# EAGLE design FB_BJ_Taster_1.53 (EAGLE 5.04)
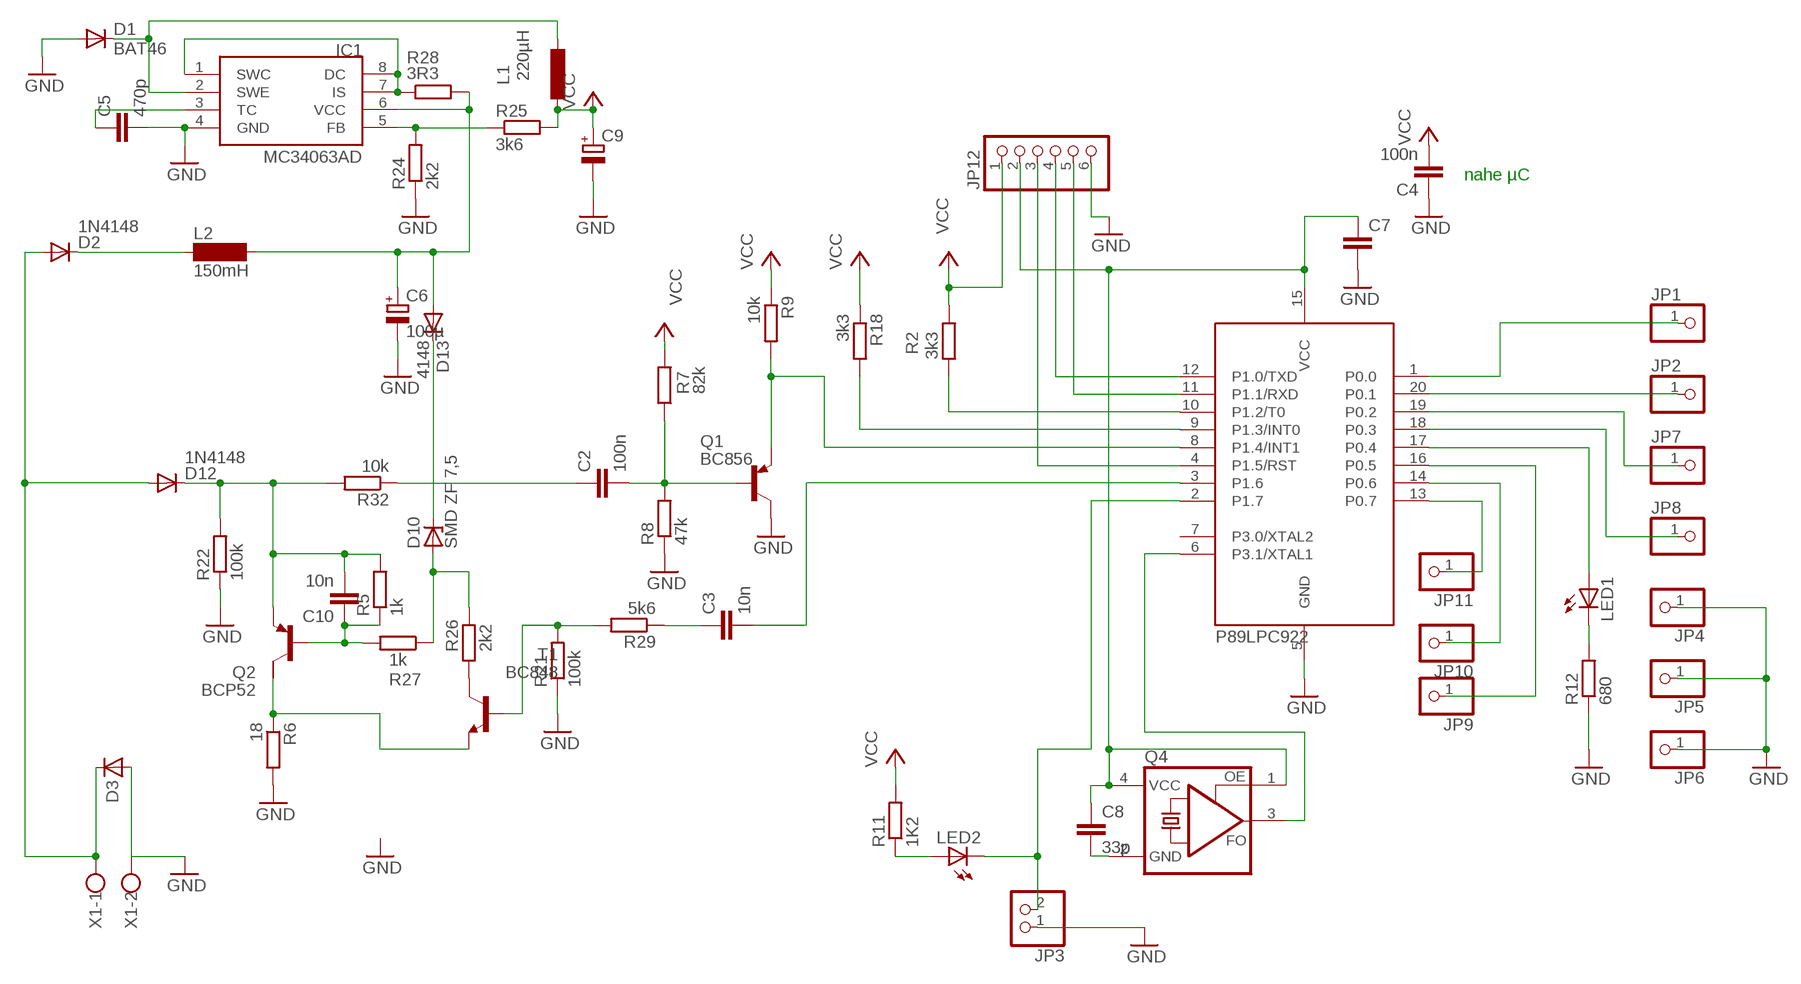
[diagram p0: schematic, sheet 1]

## Parts
C2  100n  C-EUC1206  [C1206]
C3  10n  C-EUC1206  [C1206]
C4  100n  C-EUC1206  [C1206]
C5  470p  C-EUC1206  [C1206]
C6  100µ  CPOL-EUE5-8.5  [E5-8,5]
C7  C-EUC1206  [C1206]
C8  33p  C-EUC1206  [C1206]
C9  CPOL-EUE2.5-5  [E2,5-5]
C10  10n  C-EUC1206  [C1206]
D1  BAT46  DIODE-MINIMELF  [MINIMELF]
D2  1N4148  DIODE-MINIMELF  [MINIMELF]
D3  D-SMB  [SMB]
D10  SMD ZF 7,5  ZPD  [MINIMELF]
D12  1N4148  DIODE-MINIMELF  [MINIMELF]
D13  4148  DIODE-MINIMELF  [MINIMELF]
IC1  MC34063AD  [SOIC8]
JP1  PINHD-1X1  [1X01]
JP2  PINHD-1X1  [1X01]
JP3  PINHD-1X2  [1X02]
JP4  PINHD-1X1  [1X01]
JP5  PINHD-1X1  [1X01]
JP6  PINHD-1X1  [1X01]
JP7  PINHD-1X1  [1X01]
JP8  PINHD-1X1  [1X01]
JP9  PINHD-1X1  [1X01]
JP10  PINHD-1X1  [1X01]
JP11  PINHD-1X1  [1X01]
JP12  PINHD-1X6  [1X06]
L1  220µH  L-EU2200-11.43  [2200-11.43]
L2  150mH  SD12-1000  [SD12_1000]
LED1  LED3MM  [LED3MM]
LED2  LED3MM  [LED3MM]
Q1  BC856  BC856ALT1SMD  [SOT23-BEC]
Q2  BCP52  FZT753SMD  [SOT223]
Q4  ASFL  [ASF]
R2  3k3  R-EU_M1206  [M1206]
R5  1k  R-EU_R1206  [R1206]
R6  18  R-EU_R1206  [R1206]
R7  82k  R-EU_R1206  [R1206]
R8  47k  R-EU_M1206  [M1206]
R9  10k  R-EU_R1206  [R1206]
R11  1K2  R-EU_R1206  [R1206]
R12  680  R-EU_R1206  [R1206]
R18  3k3  R-EU_R1206  [R1206]
R21  100k  R-EU_R1206  [R1206]
R22  100k  R-EU_M1206  [M1206]
R24  2k2  R-EU_R1206  [R1206]
R25  3k6  R-EU_M1206  [M1206]
R26  2k2  R-EU_M1206  [M1206]
R27  1k  R-EU_R1206  [R1206]
R28  3R3  R-EU_M1206  [M1206]
R29  5k6  R-EU_R1206  [R1206]
R32  10k  R-EU_R1206  [R1206]
T1  BC848  [SOT23]
U1  89LPC922  [DIL20]
X1  W237-02P  [W237-132]

## Nets
DRAIN: R26.1 T1.3(C)
EIB+: D2.A D3.1(C) D12.A X1.1
EIB_DC1: C6.+ D13.A IC1.6(VCC) L2.2 R28.2
EIB_SEND: C3.2 U1.3(P1.6)
EIBIN: Q1.E R9.2 U1.8(P1.4/INT1)
GATE: R21.2 R29.2 T1.1(B)
GND: C4.1 C5.2 C6.- C7.2 C9.- D1.A D3.2(A) IC1.4(GND) JP3.1 JP4.1 JP5.1 JP6.1 JP12.6 Q1.C R6.2 R8.1 R12.1 R21.1 R22.1 R24.1 U1.5(GND) X1.2
INT0: R18.2 U1.9(P1.3/INT0)
N$1: C10.1 Q2.1(B) R5.1 R27.2
N$2: C3.1 R29.1
N$5: C10.2 D12.C Q2.3(E) R5.2 R22.2 R32.2
N$6: Q2.2(C) R6.1 T1.2(E)
N$8: D2.C L2.1
N$15: LED1.A U1.17(P0.4)
N$16: JP12.3 U1.4(P1.5/RST)
N$17: JP3.2 LED2.K(C) U1.2(P1.7)
N$18: LED1.K(C) R12.2
N$19: LED2.A R11.1
N$20: JP7.1 U1.19(P0.2)
N$21: JP1.1 U1.1(P0.0)
N$22: JP2.1 U1.20(P0.1)
N$23: JP8.1 U1.18(P0.3)
N$24: JP12.4 U1.12(P1.0/TXD)
N$25: Q4.3(FO) U1.6(P3.1/XTAL1)
N$26: JP12.5 U1.11(P1.1/RXD)
N$27: C8.2 Q4.2(GND)
N$28: JP9.1 U1.16(P0.5)
N$29: JP11.1 U1.13(P0.7)
N$30: JP10.1 U1.14(P0.6)
N$31: C2.2 Q1.B R7.1 R8.2
N$50: IC1.5(FB) R24.2 R25.1
N$51: D1.C IC1.2(SWE) L1.2
N$52: C5.1 IC1.3(TC)
N$55: D10.A R26.2 R27.1
N$58: D10.C D13.C
N$63: IC1.1(SWC) IC1.7(IS) IC1.8(DC) R28.1
N$77: C2.1 R32.1
PWM: R2.2 U1.10(P1.2/T0)
VCC: C4.2 C9.+ JP12.1 L1.1 R2.1 R7.2 R9.1 R11.2 R18.1 R25.2
VCC_LPC: C7.1 C8.1 JP12.2 Q4.1(OE) Q4.4(VCC) U1.15(VCC)
Unconnected: Q2.4(C/) U1.7(P3.0/XTAL2)

## Notes on the sheet
- nahe µC
- P89LPC922

## Library data of the parts
C2-C5 C7 C8 C10 = rcl:C-EU: CAPACITOR, European symbol
C6 C9 = rcl:CPOL-EU: POLARIZED CAPACITOR, European symbol
D1 D2 D12 D13 = diode:DIODE-: DIODE
D3 = semicon-smd-ipc:D-: DIODE unfilled
D10 = diode:ZPD: Z DIODE 500 mW
IC1 = mc34063:MC34063
JP1 JP2 JP4-JP11 = pinhead:PINHD-1X1: PIN HEADER
JP3 = pinhead:PINHD-1X2: PIN HEADER
JP12 = pinhead:PINHD-1X6: PIN HEADER
L1 = rcl:L-EU: INDUCTOR, European symbol
L2 = inductor-neosid:SD12: INDUCTOR nominal inductance
LED1 LED2 = led:LED: LED OSRAM: - CHIPLED LG R971, LG N971, LY N971, LG Q971, LY Q971, LO R971, LY R971 LH N974, LH R974 LS Q976, LO Q976, LY Q976 LO Q996 - Hyper CHIPLED LW Q18S LB Q993, LB Q99A, LB R99A - SideLED LS A670, LO A670, LY A670, LG A670, LP A670 LB A673, LV A673, LT A673, LW A673 LH A674 LY A675 LS A676, LA A676, LO A676, LY A676, LW A676 LS A679, LY A679, LG A679 - Hyper Micro SIDELED® LS Y876, LA Y876, LO Y876, LY Y876 LT Y87S - SmartLED LW L88C, LW L88S LB L89C, LB L89S, LG L890 LS L89K, LO L89K, LY L89K LS L896, LA L896, LO L896, LY L896 - TOPLED LS T670, LO T670, LY T670, LG T670, LP T670 LSG T670, LSP T670, LSY T670, LOP T670, LYG T670 LG T671, LOG T671, LSG T671 LB T673, LV T673, LT T673, LW T673 LH T674 LS T676, LA T676, LO T676, LY T676, LB T676, LH T676, LSB T676, LW T676 LB T67C, LV T67C, LT T67C, LS T67K, LO T67K, LY T67K, LW E67C LS E67B, LA E67B, LO E67B, LY E67B, LB E67C, LV E67C, LT E67C LW T67C LS T679, LY T679, LG T679 LS T770, LO T770, LY T770, LG T770, LP T770 LB T773, LV T773, LT T773, LW T773 LH T774 LS E675, LA E675, LY E675, LS T675 LS T776, LA T776, LO T776, LY T776, LB T776 LHGB T686 LT T68C, LB T68C - Hyper Mini TOPLED® LB M676 - Mini TOPLED Santana® LG M470 LS M47K, LO M47K, LY M47K Source: http://www.osram.convergy.de - LUMILED® LXK2-PW12-R00, LXK2-PW12-S00, LXK2-PW14-U00, LXK2-PW14-V00 LXK2-PM12-R00, LXK2-PM12-S00, LXK2-PM14-U00 LXK2-PE12-Q00, LXK2-PE12-R00, LXK2-PE12-S00, LXK2-PE14-T00, LXK2-PE14-U00 LXK2-PB12-K00, LXK2-PB12-L00, LXK2-PB12-M00, LXK2-PB14-N00, LXK2-PB14-P00, LXK2-PB14-Q00 LXK2-PR12-L00, LXK2-PR12-M00, LXK2-PR14-Q00, LXK2-PR14-R00 LXK2-PD12-Q00, LXK2-PD12-R00, LXK2-PD12-S00 LXK2-PH12-R00, LXK2-PH12-S00 LXK2-PL12-P00, LXK2-PL12-Q00, LXK2-PL12-R00 Source: www.luxeon.com
Q1 = transistor-pnp:BC856*: PNP Transistror
Q2 = transistor-pnp:FZT753SMD: PNP Transistor
Q4 = crystal:ASF*: CRYSTAL CLOCK OSCILLATORS 5.0 Vdc or 3.3 Vdc - LOW PROFILE ULTRA MINIATURE CERAMIC SURFACE MOUNT Source: http://www.abracon.com/Oscillators/asf1-L-L1.pdf
R2 R5-R9 R11 R12 R18 R21 R22 R24-R29 R32 = rcl:R-EU_: RESISTOR, European symbol
T1 = transistor:BC848: NPN TRANSISTOR
U1 = micro-philips:89LPC922
X1 = con-wago-508:W237-02P: WAGO SREW CLAMP

## Board
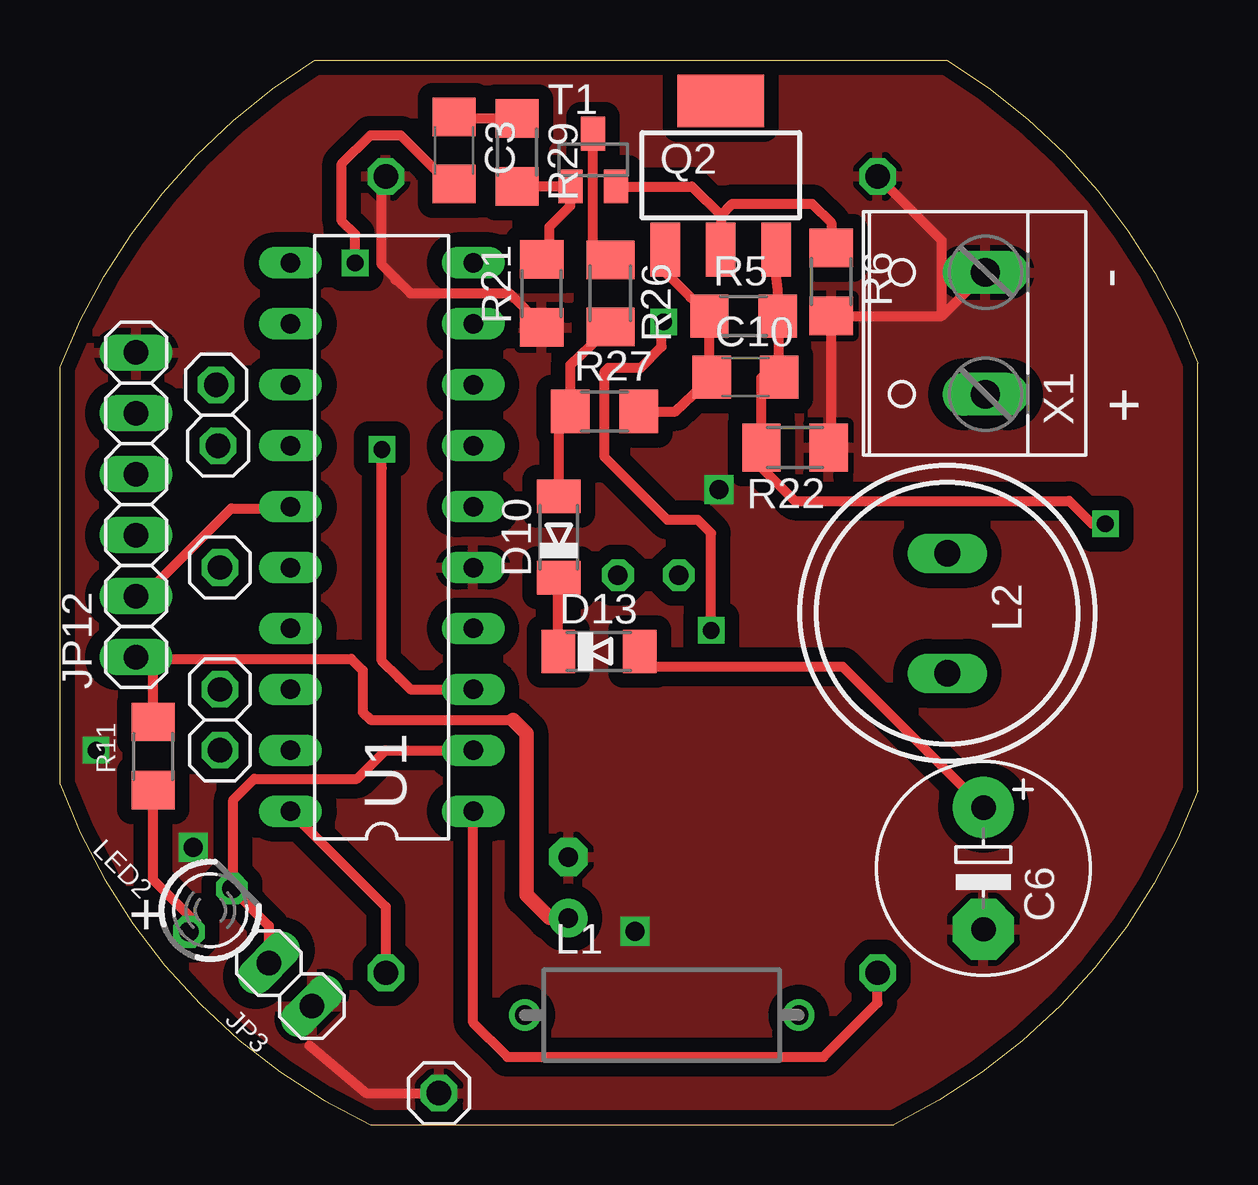
[diagram p1: board, top side]
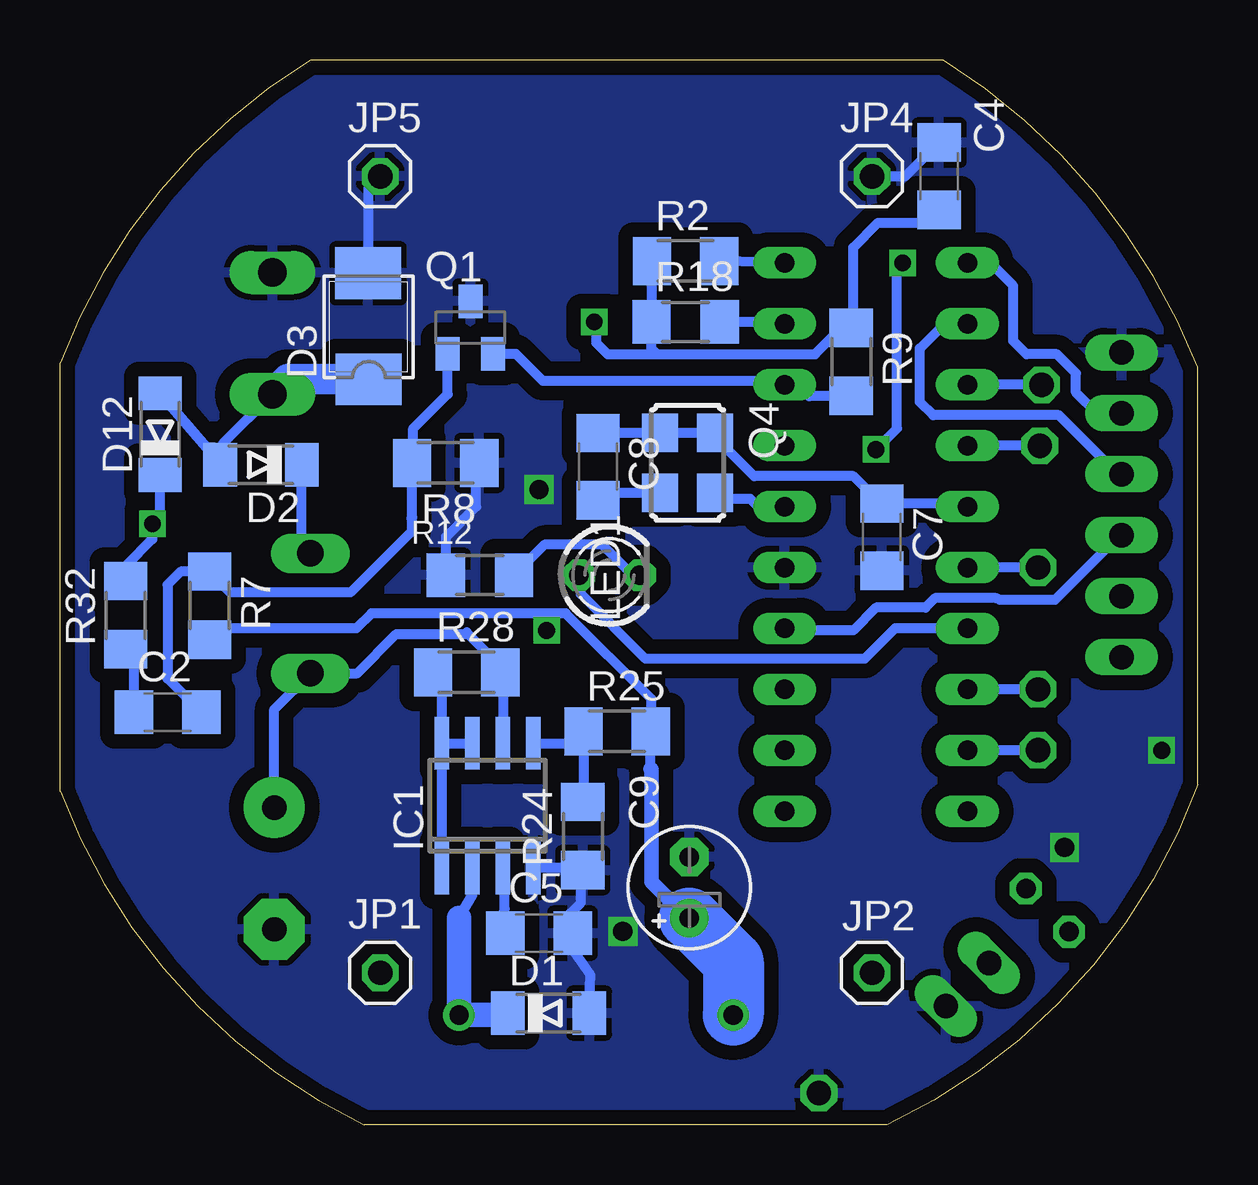
[diagram p2: board, bottom side, seen from below]

Size 47.43 x 44.38 mm. Coordinates in mm from the lower left corner, seen from the top.
Outline: 10.62,44.38 36.97,44.38
Outline: 47.42,13.9 47.43,31.75
Outline: 12.95,0 34.75,0
Outline: 12.95,0 arc-44 0,14.19 0,31.58 arc-36 10.61,44.38
Outline: 36.98,44.38 arc-38 47.43,31.76
Outline: 47.42,13.91 arc-44 34.75,0
Copper layers (1*16): Top 0.035mm / dielectric 1.5mm / Bottom 0.035mm
Design rules "default *": minimum track width 10mil, minimum drill 24mil, track to track 8mil, track to pad 8mil, pad to pad 8mil, via to via 8mil, smd to smd 8mil, copper to edge 20mil, drill to drill 8mil, minimum pad ring 10mil, minimum via ring 8mil, stop-mask expansion 4mil, vias tented up to drill 0mil, thermal gap 10mil

### Footprints (pad centres in the part's own frame; a part is rotated, then mirrored left to right if it is on the bottom)
C1206 = smd 1.6 x 1.8: 1 -1.4,0; 2 1.4,0
E5-8,5 = drill 1.016 pad 2.54 round: + -2.54,0 | drill 1.016 pad 2.54 octagon: - 2.54,0
E2,5-5 = drill 0.813 pad 1.6 round: + -1.27,0 | drill 0.813 pad 1.6 octagon: - 1.27,0
MINIMELF = smd 1.4 x 1.8: A 1.7,0; C -1.7,0
SMB = smd 2.159 x 2.743: 1 -2.311,-0.127; 2 2.108,-0.102
SOIC8 = smd 0.6 x 2.2: 1 -1.905,-2.6; 2 -0.635,-2.6; 3 0.635,-2.6; 4 1.905,-2.6; 5 1.905,2.6; 6 0.635,2.6; 7 -0.635,2.6; 8 -1.905,2.6
1X01 = drill 1.016 octagon: 1 0,0
1X02 = drill 1.016 long: 1 -1.27,0; 2 1.27,0
1X06 = drill 1.016 long: 1 -6.35,0; 2 -3.81,0; 3 -1.27,0; 4 1.27,0; 5 3.81,0; 6 6.35,0
2200-11.43 = drill 0.8 pad 1.27 round: 1 -5.715,0; 2 5.715,0
SD12_1000 = drill 1.1 long: 1 -2.5,0; 2 2.5,0
LED3MM = drill 0.813 octagon: A -1.27,0; K 1.27,0
SOT23-BEC = smd 1 x 1.4: B -0.95,-1.1; C 0,1.1; E 0.95,-1.1
SOT223 = smd 1.219 x 2.235: 1 -2.311,-3.099; 2 0,-3.099; 3 2.311,-3.099 | smd 3.6 x 2.2: 4 0,3.099
ASF = smd 1.6 x 1.5: 1 -1.25,-1.15; 2 1.25,-1.15; 3 1.25,1.15; 4 -1.25,1.15
M1206 = smd 1.6 x 2: 1 -1.4,0; 2 1.4,0
R1206 = smd 1.6 x 1.803: 1 -1.422,0; 2 1.422,0
SOT23 = smd 1 x 1.4: 1 -0.95,-1.1; 2 0.95,-1.1; 3 0,1.1
DIL20 = drill 0.813 long: 1 -11.43,-3.81; 2 -8.89,-3.81; 3 -6.35,-3.81; 4 -3.81,-3.81; 5 -1.27,-3.81; 6 1.27,-3.81; 7 3.81,-3.81; 8 6.35,-3.81; 9 8.89,-3.81; 10 11.43,-3.81; 11 11.43,3.81; 12 8.89,3.81; 13 6.35,3.81; 14 3.81,3.81; 15 1.27,3.81; 16 -1.27,3.81; 17 -3.81,3.81; 18 -6.35,3.81; 19 -8.89,3.81; 20 -11.43,3.81
W237-132 = drill 1.194 long: 1 -2.54,-0.635; 2 2.54,-0.635

### Placement (x,y rotation side)
C2  42.94,17.19 0 bottom
C3  16.43,40.61 270 top
C4  10.79,39.54 270 bottom
C5  27.46,7.99 0 bottom
C6  38.5,10.69 270 top
C7  13.18,24.5 270 bottom
C8  25,27.43 270 bottom
C9  21.19,9.89 90 bottom
C10  28.57,31.16 0 top
D1  27.07,4.65 0 bottom
D2  39.05,27.51 180 bottom
D3  34.69,33.39 90 bottom
D10  20.8,24.5 90 top
D12  43.26,28.78 90 bottom
D13  22.46,19.73 0 top
IC1  29.61,13.31 0 bottom
JP1  34.08,6.33 0 bottom
JP2  13.58,6.33 0 bottom
JP3  9.6,5.84 135 top
JP4  13.58,39.53 0 bottom
JP5  34.08,39.53 0 bottom
JP6  15.8,1.32 0 top
JP7  6.67,15.61 0 top
JP8  6.67,18.15 0 top
JP9  6.67,23.23 0 top
JP10  6.59,28.31 0 top
JP11  6.51,30.85 0 top
JP12  3.17,25.85 90 top
L1  25.08,4.57 0 top
L2  36.99,21.32 270 top
LED1  24.53,22.91 0 bottom
LED2  6.27,8.94 45 top
Q1  30.32,33.23 0 bottom
Q2  27.54,39.58 0 top
Q4  21.27,27.59 270 bottom
R2  21.35,36.01 0 bottom
R5  28.5,33.7 0 top
R6  32.15,35.13 270 top
R7  41.2,21.64 270 bottom
R8  31.35,27.59 180 bottom
R9  14.45,31.8 270 bottom
R11  3.89,15.37 90 top
R12  29.92,22.91 0 bottom
R18  21.35,33.47 0 bottom
R21  20.08,34.66 90 top
R22  30.64,28.23 180 top
R24  25.64,12.03 90 bottom
R25  24.21,16.4 0 bottom
R26  22.94,34.66 270 top
R27  22.7,29.74 0 top
R28  30.48,18.86 0 bottom
R29  19.05,40.53 270 top
R32  44.69,21.24 90 bottom
T1  22.22,40.21 0 top
U1  13.41,24.5 90 top
X1  37.94,32.99 90 top

### Tracks (layer width: path | path; a pad name or v marks a point on that pad's centre or on a via)
DRAIN
  Top 0.406: T1.3 22.22,36.69 R26.1
EIB+
  Bottom 0.406: X1.1 40.64,28.39 D2.A 40.64,27.91 40.96,28.23 41.32,28.23 D12.A
  Bottom 1.27: D3.1 37.95,31.08 X1.1
EIB_DC1
  Top 0.406: D13.A 24.8,19.1 32.62,19.1 C6.+
  Bottom 0.406: IC1.6 28.97,18.75 R28.2 29.08,19.13 30.48,20.53 30.56,20.45 33.42,20.45 35.04,18.82 L2.2 38.5,17.31 C6.+
EIB_SEND  (via drill 0.7)
  Top 0.406: C3.2 16.43,39.1 15.95,38.63 15.95,39.5 14.21,41.25 12.94,41.25 11.75,40.05 11.75,37.67 12.3,37.12 v12.3,35.93 | 14.13,18.62 13.41,19.34 13.41,27.35 v13.41,28.15 | 14.13,18.62 | 14.13,18.62 14.6,18.15 U1.3 | U1.3
  Bottom 0.406: v12.3,35.93 12.54,35.69 12.54,31.01 12.54,29.02 v13.41,28.15
EIBIN
  Bottom 0.406: Q1.E 28.43,32.13 27.3,31.01 17.38,31.01 U1.8 16.67,30.85 16.19,30.37 R9.2
GATE
  Top 0.406: R21.2 20.4,36.16 20.4,37.44 21.27,38.31 T1.1 R29.2
GND  (via drill 0.7, 0.8)
  Top 0.406: R22.1 32.15,28.34 R6.2 36.76,33.71 | 36.76,33.71 X1.2 | 36.76,33.71 36.76,36.85 JP5.1 | 13.97,35.29 13.41,35.85 13.41,39.37 JP4.1 | 13.97,35.29 14.6,34.66 18.73,34.66 20.07,33.31 R21.1 20.4,33.15 | JP6.1 12.78,1.32 10.4,3.3 | 13.97,35.29 13.97,35.21
  Bottom 0.406: R12.1 31.35,24.5 30.08,25.77 30.08,27.46 R8.1 | R24.1 25.72,10.53 25.72,9.26 26.46,8.51 C5.2 26.51,7.94 25.32,6.24 25.37,5.25 D1.A | IC1.4 25.73,10.71 R24.1 | R24.1 25.33,10.92 | D3.2 34.58,39.03 JP5.1 | C4.1 12.19,39.53 JP4.1
  other vias: 27.46,26.48 5.56,11.56 23.97,8.07 1.51,15.61
  pour Bottom (isolate 0.61): 8.49,45.21 38.34,45.21 48.66,34.9 48.66,11.48 35.8,-1.38 10.79,-1.38 -1.03,10.45 -1.03,35.69
  pour Top (isolate 0.61): -0.95,35.69 -0.87,35.69 8.57,45.13 38.58,45.13 48.89,34.82 48.89,11.8 35.8,-1.3 10.87,-1.3 -0.87,10.45
INT0
  Bottom 0.406: R18.2 17.3,33.47 U1.9
N$1
  Top 0.406: Q2.1 25.32,36.39 25.32,35.45 26.27,34.5 R5.1 27.07,31.19 C10.1 25.67,29.74 R27.2
N$2
  Top 0.406: R29.1 16.49,41.95 C3.1
N$5  (via drill 0.7)
  Top 0.406: Q2.3 29.85,35.46 29.92,34.82 R5.2 29.97,33.57 C10.2 29.24,31.14 R22.2 29.24,27.41 30.64,26.01 42.07,26.01 43.02,25.05 v43.58,25.05
  Bottom 0.406: 43.62,27.04 D12.C 43.26,25.37 v43.58,25.05 43.58,24.41 44.69,23.3 R32.2
N$6
  Top 0.406: R6.1 32.15,37.59 31.35,38.39 28.02,38.39 27.54,37.91 | 27.54,37.91 Q2.2 | Q2.2 | T1.2 26.34,39.11 27.54,37.91
N$8
  Bottom 0.406: L2.1 37.35,24.19 D2.C
N$15
  Bottom 0.406: U1.17 12.62,20.69 13.89,19.42 23.02,19.42 25.72,22.12 25.72,22.83 LED1.A
N$16
  Bottom 0.406: JP12.3 3.25,24.58 5.95,21.88 8.25,21.88 8.41,21.96 10.95,21.96 11.35,21.56 13.41,21.56 14.37,20.61 17.14,20.61 U1.4
N$17
  Top 0.406: JP3.2 8.71,8.3 LED2.K 7.22,9.89 7.22,13.54 8.1,14.42 12.38,14.42 13.57,15.61 U1.2
N$18
  Bottom 0.406: LED1.K 23.57,22.91 24.84,24.18 27.23,24.18 R12.2
N$19
  Top 0.406: LED2.A 5.37,8.73 3.89,10.21 R11.1
N$20
  Bottom 0.406: JP7.1 U1.19 | U1.19
N$21
  Top 0.406: 34.01,6.4 JP1.1 34.08,5.08 31.83,2.83 18.65,2.83 17.22,4.26 U1.1
N$22
  Top 0.406: JP2.1 13.58,9.09 U1.20
N$23
  Bottom 0.406: JP8.1 U1.18
N$24
  Bottom 0.406: JP12.4 3.33,27.12 5.79,29.58 11.03,29.58 11.59,30.13 11.59,32.36 10.48,33.47 9.68,33.47 U1.12
N$25
  Bottom 0.406: Q4.3 20.1,26.34 19.84,26.08 18.65,26.08 18.34,25.77 U1.6
N$26
  Bottom 0.406: JP12.5 | JP12.5 4.21,29.66 5.08,30.53 5.08,31.32 5.87,32.12 7.14,32.12 7.7,32.67 7.7,34.97 8.65,35.93 U1.11
N$27
  Bottom 0.406: Q4.2 24.69,26.34 C8.2
N$28
  Bottom 0.406: JP9.1 9.45,23.23 U1.16
N$29
  Bottom 0.406: JP11.1 U1.13
N$30
  Bottom 0.406: JP10.1 U1.14 | U1.14
N$31
  Bottom 0.406: Q1.B 31.27,30.45 32.7,29.02 32.7,27.64 R8.2 32.75,25.32 32.78,25.29 32.78,24.74 35.32,22.2 40.33,22.2 R7.1 42.39,23.06 42.94,22.51 42.94,18.59 C2.2
N$50
  Bottom 0.406: IC1.5 26.1,15.91 R25.1 25.61,13.49 R24.2
N$51
  Bottom 0.406: IC1.2 30.24,9.57 30.8,8.62 | D1.C 28.85,4.57
  Bottom 1.016: 28.85,4.57 L1.2 30.8,8.62
N$52
  Bottom 0.406: C5.1 28.94,8.65 28.89,9.02 28.89,10.63 IC1.3
N$55
  Top 0.406: D10.A 20.8,30.44 R27.1 21.28,31.68 R26.2
N$58
  Top 0.406: D13.C 20.76,22.76 D10.C
N$63
  Bottom 0.406: IC1.8 31.51,18.49 R28.1 | IC1.8 IC1.7 | IC1.1 IC1.8
N$77
  Bottom 0.406: R32.1 44.34,20.27 C2.1
PWM
  Bottom 0.406: R2.2 U1.10
VCC  (via drill 0.7)
  Top 0.406: R11.2 3.89,19.42 JP12.1 3.25,19.42 12.14,19.42 12.62,18.94 12.62,17.19 12.94,16.88 18.89,16.88 | v25.16,33.47 25.08,33.39 25.08,32.43 24.21,31.56 22.86,31.56 22.7,31.4 22.7,27.83 25.32,25.21 26.59,25.21 27.15,24.66 v27.15,20.61
  Top 0.61: C9.+ 20.4,8.62 19.45,9.57 19.45,16.32 18.89,16.88
  Bottom 0.406: R2.1 22.75,33.49 R18.1 22.78,32.36 22.54,32.12 | 22.81,14.84 R25.2 22.78,16.43 22.78,17.75 26.35,21.32 27.15,21.32 | 22.54,32.12 15.95,32.12 14.85,33.22 R9.1 14.37,33.3 14.37,36.56 13.33,37.59 10.72,37.59 10.79,37.66 C4.2 | 22.54,32.12 24.61,32.12 25.08,32.59 25.08,33.47 v25.16,33.47 | 27.15,21.32 v27.15,20.61 | R7.2 40.73,20.69 35.08,20.69 34.45,21.32 27.15,21.32
  Bottom 0.61: 22.81,14.84 22.78,14.81 22.78,10.13 21.27,8.62 C9.+
  Bottom 1.016: L1.1 19.45,4.65
  Bottom 2.54: C9.+ 19.37,6.8 L1.1
VCC_LPC
  Top 0.406: JP12.2 3.49,22.04 7.14,25.69 9.52,25.69 U1.15
  Bottom 0.406: C8.1 Q4.1 Q4.4 20.12,28.67 18.49,27.04 14.37,27.04 13.23,25.9 C7.1 9.73,25.9 U1.15

### Text on the board
tPlace: - | + | +